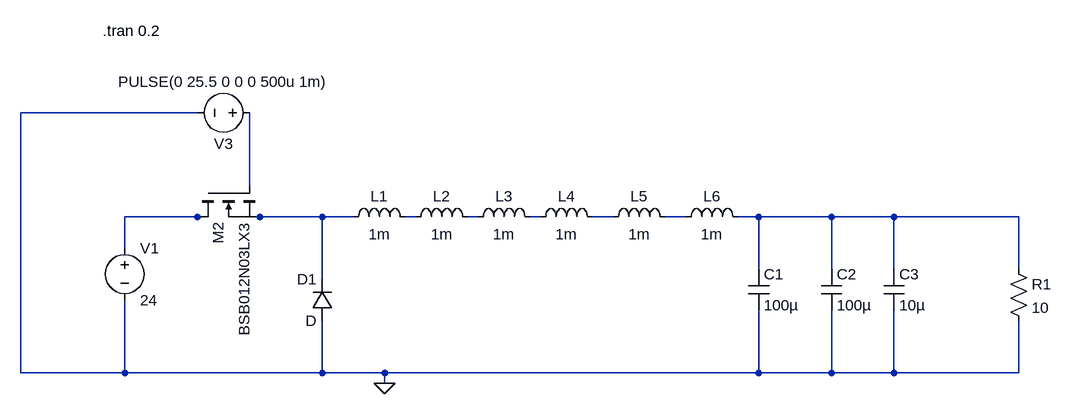
[diagram p0: schematic Draft12.asc]
Draft12.asc, the LTspice schematic file:
Version 4
SHEET 1 1944 740
WIRE -128 224 -400 224
WIRE -48 336 -48 224
WIRE -128 384 -240 384
WIRE -112 384 -128 384
WIRE -32 384 -48 384
WIRE 64 384 -32 384
WIRE 112 384 64 384
WIRE 208 384 192 384
WIRE 304 384 288 384
WIRE 400 384 384 384
WIRE 512 384 480 384
WIRE 624 384 592 384
WIRE 736 384 704 384
WIRE 848 384 736 384
WIRE 944 384 848 384
WIRE 1136 384 944 384
WIRE -240 432 -240 384
WIRE 736 464 736 384
WIRE 848 464 848 384
WIRE 944 464 944 384
WIRE 1136 464 1136 384
WIRE 64 480 64 384
WIRE -400 624 -400 224
WIRE -240 624 -240 512
WIRE -240 624 -400 624
WIRE 64 624 64 544
WIRE 64 624 -240 624
WIRE 160 624 64 624
WIRE 736 624 736 528
WIRE 736 624 160 624
WIRE 848 624 848 528
WIRE 848 624 736 624
WIRE 944 624 944 528
WIRE 944 624 848 624
WIRE 1136 624 1136 544
WIRE 1136 624 944 624
WIRE 160 640 160 624
FLAG 160 640 0
SYMBOL voltage -240 416 R0
WINDOW 123 0 0 Left 0
WINDOW 39 0 0 Left 0
SYMATTR InstName V1
SYMATTR Value 24
SYMBOL diode 80 544 R180
WINDOW 0 24 64 Left 2
WINDOW 3 24 0 Left 2
SYMATTR InstName D1
SYMBOL ind 192 400 R270
WINDOW 0 32 56 VTop 2
WINDOW 3 5 56 VBottom 2
SYMATTR InstName L2
SYMATTR Value 1m
SYMBOL res 1120 448 R0
SYMATTR InstName R1
SYMATTR Value 10
SYMBOL cap 720 464 R0
SYMATTR InstName C1
SYMATTR Value 100µ
SYMBOL nmos -128 336 M90
SYMATTR InstName M2
SYMATTR Value BSB012N03LX3
SYMBOL voltage -32 224 R90
WINDOW 0 32 56 VTop 2
WINDOW 3 -32 56 VBottom 2
WINDOW 123 0 0 Left 0
WINDOW 39 0 0 Left 0
SYMATTR InstName V3
SYMATTR Value PULSE(0 25.5 0 0 0 500u 1m)
SYMBOL ind 96 400 R270
WINDOW 0 32 56 VTop 2
WINDOW 3 5 56 VBottom 2
SYMATTR InstName L1
SYMATTR Value 1m
SYMBOL ind 288 400 R270
WINDOW 0 32 56 VTop 2
WINDOW 3 5 56 VBottom 2
SYMATTR InstName L3
SYMATTR Value 1m
SYMBOL ind 384 400 R270
WINDOW 0 32 56 VTop 2
WINDOW 3 5 56 VBottom 2
SYMATTR InstName L4
SYMATTR Value 1m
SYMBOL ind 496 400 R270
WINDOW 0 32 56 VTop 2
WINDOW 3 5 56 VBottom 2
SYMATTR InstName L5
SYMATTR Value 1m
SYMBOL ind 608 400 R270
WINDOW 0 32 56 VTop 2
WINDOW 3 5 56 VBottom 2
SYMATTR InstName L6
SYMATTR Value 1m
SYMBOL cap 832 464 R0
SYMATTR InstName C2
SYMATTR Value 100µ
SYMBOL cap 928 464 R0
SYMATTR InstName C3
SYMATTR Value 10µ
TEXT -274 98 Left 2 !.tran 0.2

The netlist it stands for:
* Draft12.asc
V1 N002 0 24
D1 0 N003 D
L2 N004 N005 1m
R1 N009 0 10
C1 N009 0 100µ
M2 N002 N001 N003 N003 BSB012N03LX3
V3 N001 0 PULSE(0 25.5 0 0 0 500u 1m)
L1 N003 N004 1m
L3 N005 N006 1m
L4 N006 N007 1m
L5 N007 N008 1m
L6 N008 N009 1m
C2 N009 0 100µ
C3 N009 0 10µ
.model D D
.lib standard.dio
.model NMOS NMOS
.model PMOS PMOS
.lib standard.mos
.tran 0.2
.backanno
.end